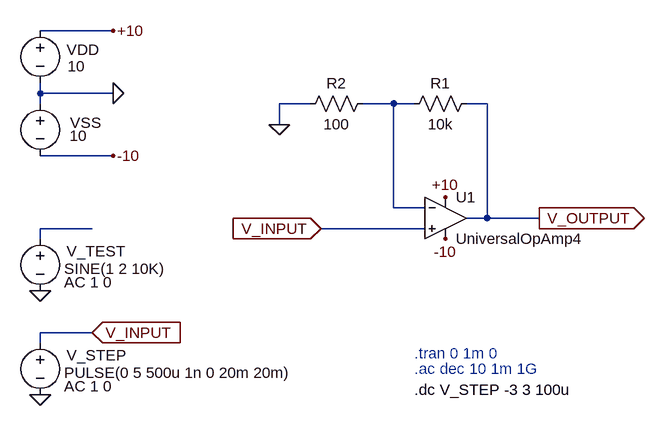
[diagram p0: schematic test.asc]
test.asc, the LTspice schematic file:
Version 4
SHEET 1 880 680
WIRE 32 -384 -80 -384
WIRE -80 -288 -80 -304
WIRE 32 -288 -80 -288
WIRE -80 -272 -80 -288
WIRE 336 -272 288 -272
WIRE 464 -272 416 -272
WIRE 496 -272 464 -272
WIRE 608 -272 576 -272
WIRE 288 -240 288 -272
WIRE 32 -192 -80 -192
WIRE 464 -112 464 -272
WIRE 512 -112 464 -112
WIRE 608 -96 608 -272
WIRE 608 -96 576 -96
WIRE 688 -96 608 -96
WIRE 0 -80 -80 -80
WIRE 512 -80 352 -80
WIRE -80 -64 -80 -80
WIRE 0 80 -80 80
WIRE -80 96 -80 80
FLAG 32 -384 +10
FLAG 32 -192 -10
FLAG 32 -288 0
FLAG 352 -80 V_INPUT
IOPIN 352 -80 In
FLAG 688 -96 V_OUTPUT
IOPIN 688 -96 Out
FLAG 544 -128 +10
FLAG 544 -64 -10
FLAG -80 16 0
FLAG 0 80 V_INPUT
IOPIN 0 80 In
FLAG -80 176 0
FLAG 288 -240 0
SYMBOL res 592 -288 R90
WINDOW 0 0 56 VBottom 2
WINDOW 3 32 56 VTop 2
SYMATTR InstName R1
SYMATTR Value 10k
SYMBOL voltage -80 -400 R0
WINDOW 0 41 45 Left 2
WINDOW 3 42 70 Left 2
WINDOW 123 0 0 Left 0
WINDOW 39 0 0 Left 0
SYMATTR InstName VDD
SYMATTR Value 10
SYMBOL voltage -80 -288 R0
WINDOW 0 46 45 Left 2
WINDOW 3 45 65 Left 2
WINDOW 123 0 0 Left 0
WINDOW 39 0 0 Left 0
SYMATTR InstName VSS
SYMATTR Value 10
SYMBOL voltage -80 -80 R0
WINDOW 0 41 35 Left 2
WINDOW 3 37 62 Left 2
WINDOW 123 37 83 Left 2
WINDOW 39 0 0 Left 0
SYMATTR InstName V_TEST
SYMATTR Value SINE(1 2 10K)
SYMATTR Value2 AC 1 0
SYMBOL voltage -80 80 R0
WINDOW 0 41 35 Left 2
WINDOW 3 37 62 Left 2
WINDOW 123 37 83 Left 2
WINDOW 39 0 0 Left 0
SYMATTR InstName V_STEP
SYMATTR Value PULSE(0 5 500u 1n 0 20m 20m)
SYMATTR Value2 AC 1 0
SYMBOL OpAmps\\UniversalOpAmp4 544 -96 R0
SYMATTR InstName U1
SYMATTR Value2 Avol=205k GBW=4MEG Slew=13MEG
SYMATTR SpiceLine Ilimit=25m Rail=0.6 Vos=5m Phimargin=45
SYMATTR SpiceLine2 En=0 Enk=0 In=0 Ink=0 Rin=1000000000000 Ro=1k Ccm=1p Cdiff=2p
SYMBOL res 432 -288 R90
WINDOW 0 0 56 VBottom 2
WINDOW 3 32 56 VTop 2
SYMATTR InstName R2
SYMATTR Value 100
TEXT 496 112 Left 2 ;.tran 0 1m 0
TEXT 496 136 Left 2 ;.ac dec 10 1m 1G
TEXT 496 168 Left 2 !.dc V_STEP -3 3 100u

The netlist it stands for:
* test.asc
R1 V_OUTPUT N001 10k
VDD +10 0 10
VSS 0 -10 10
V_TEST N002 0 SINE(1 2 10K) AC 1 0
V_STEP V_INPUT 0 PULSE(0 5 500u 1n 0 20m 20m) AC 1 0
* U1: UniversalOpAmp4 Avol=205k GBW=4MEG Slew=13MEG Ilimit=25m Rail=0.6 Vos=5m Phimargin=45 En=0 Enk=0 In=0 Ink=0 Rin=1000000000000 Ro=1k Ccm=1p Cdiff=2p (symbol OpAmps\UniversalOpAmp4 not available, pins judged from their places): In+=V_INPUT In-=N001 V+=+10 V-=-10 OUT=V_OUTPUT
R2 N001 0 100
* .tran 0 1m 0
* .ac dec 10 1m 1G
.dc V_STEP -3 3 100u
.backanno
.end